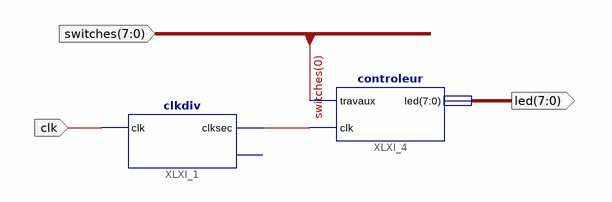
[diagram p0: schematic sheet 1]
// Xilinx ISE schematic toplevel.sch (spartan3e) as structural Verilog: 2 symbols, 3 ports
module toplevel (
  input  clk,
  input  [7:0] switches,
  output [7:0] led
);

  wire XLXN_11;

  controleur XLXI_4 (.travaux(switches[0]), .clk(XLXN_11), .led(led));
  clkdiv XLXI_1 (.clk(clk), .clksec(XLXN_11));  // open: clk190
endmodule
